# Altium project PCB_Project_H_Bridge.PrjPcb
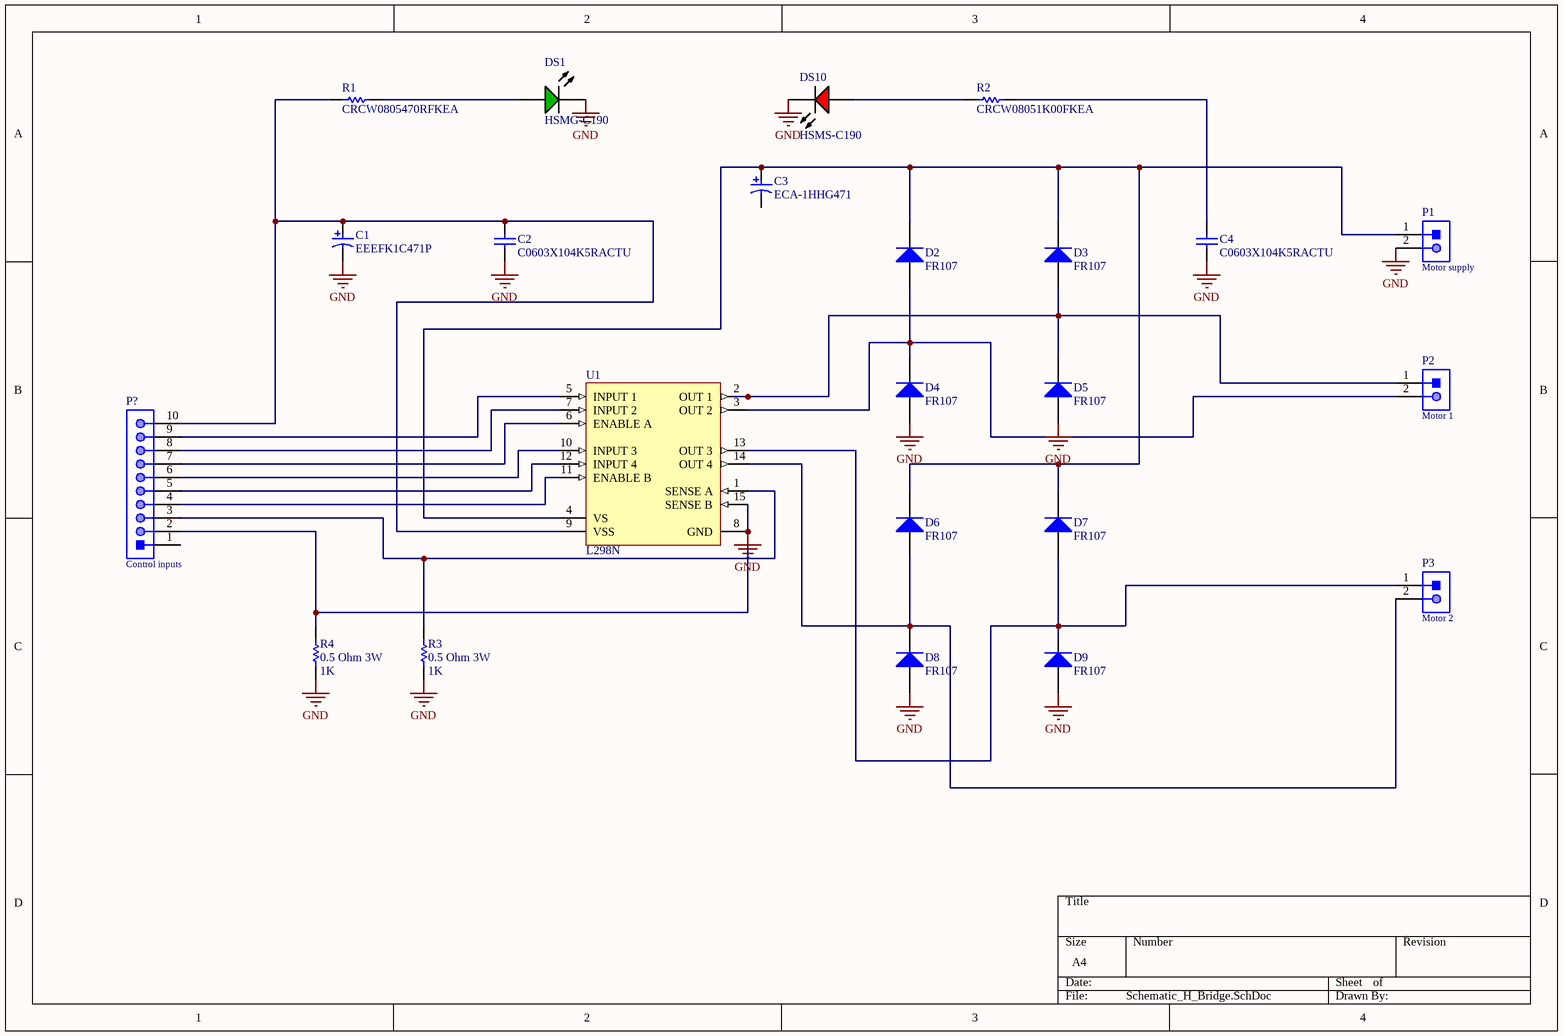
[diagram p0: Schematic_H_Bridge.SchDoc]
1 sheet, 23 parts. Net scope: global (net labels, ports and power ports of the same name join across sheets).

## Sheet Schematic_H_Bridge.SchDoc
size A4

### Parts
C1  EEEFK1C471P  [PNSC-FK-V-F_V]
C2  C0603X104K5RACTU  [CAPC1608X87X35NL15T15]
C3  ECA-1HHG471  [PNSC-CAP-10x20-P2]
C4  C0603X104K5RACTU  [CAPC1608X87X35NL15T15]
D2  FR107  [SMC]
D3  FR107  [SMC]
D4  FR107  [SMC]
D5  FR107  [SMC]
D6  FR107  [SMC]
D7  FR107  [SMC]
D8  FR107  [SMC]
D9  FR107  [SMC]
DS1  HSMG-C190  [AVAG-HSMX-C190_V]
DS10  HSMS-C190  [AVAG-HSMX-C190_V]
P1  Motor supply  [61300211021]
P2  Motor 1  [61300211021]
P3  Motor 2  [61300211021]
P?  Control inputs  [691701320010B]
R1  CRCW0805470RFKEA  [RESC2013X50X30LL20T20]
R2  CRCW08051K00FKEA  [RESC2013X50X30NL20T20]
R3  0.5 Ohm 3W  value 1K  [AXIAL-0.3]
R4  0.5 Ohm 3W  value 1K  [AXIAL-0.3]
U1  L298N  [STM-FM-15]

### Nets
GND: C1.2 C2.1 C4.1 D4.1(A) D5.1(A) D8.1(A) D9.1(A) DS1.2(K) DS10.2(K) P1.2 P?.2 R3.1 R4.1 R4.2 U1.8(GND) U1.15(SENSE_B)
NetC1_1: C1.1 C2.2 P?.10 R1.1 U1.9(VSS)
NetC3_1: C3.1 D2.2(K) D3.2(K) D6.2(K) D7.2(K) P1.1 U1.4(VS)
NetC4_2: C4.2 R2.2
NetD2_1: D2.1(A) D4.2(K) P2.2 U1.3(OUT_2)
NetD3_1: D3.1(A) D5.2(K) P2.1 U1.2(OUT_1)
NetD6_1: D6.1(A) D8.2(K) P3.2 U1.14(OUT_4)
NetD7_1: D7.1(A) D9.2(K) P3.1 U1.13(OUT_3)
NetDS1_1: DS1.1(A) R1.2
NetDS10_1: DS10.1(A) R2.1
NetP?_3: P?.3 R3.2 U1.1(SENSE_A)
NetP?_4: P?.4 U1.11(ENABLE_B)
NetP?_5: P?.5 U1.12(INPUT_4)
NetP?_6: P?.6 U1.10(INPUT_3)
NetP?_7: P?.7 U1.6(ENABLE_A)
NetP?_8: P?.8 U1.7(INPUT_2)
NetP?_9: P?.9 U1.5(INPUT_1)

Not connected (* = marked no-connect by the designer): C3 2; P? 1

### Library data of the parts
C1 = CMP-2000-06204-1: Aluminum Electrolytic Capacitor, 470 uF, +/- 20%, 16 V, 2-Pin SMD (Size Code F), -55 to 105 degC, RoHS, Tape and Reel; Manufacturer: Panasonic; Capacitance: 470µF; Type: Can; Ripple Current: 600mA; Lifetime@Temperature: 2000Hrs@105°C; Impedance: 0.16O; Rated Voltage: 16V; Manufacturer URL: http://www.panasonic.com/; Package Description: 2-Pin Electrolytic Aluminum Capacitor, Body 8.3 x 8.3 mm; Operating Temp-Max: 105°C; Mounting Technology: SurfaceMount; Operating Temp Range: -55to+105°C; Datasheet Version: 03/2016; Series: FK; Package Reference: FK-V-F; Case Size/Dimension: Ø8x10.2mm; Package URL: http://industrial.panasonic.com/cdbs/www-data/pdf/RDE0000/DME0000COL48.pdf; Datasheet URL: http://industrial.panasonic.com/cdbs/www-data/pdf/RDE0000/ABA0000C1181.pdf
C2 C4 = CMP-2006-03300-1: Manufacturer: Kemet; Part Number: C0603X104K5RACTU
C3 = CMP-2000-05308-1: Aluminum Electrolytic Capacitor, 470 uF, +/- 20%, 50 V, -55 to 105 degC, 2-Pin THD, RoHS, Bulk; Manufacturer: Panasonic; Package Version: Nov-12; Type: Radial; Lifetime@Temperature: 2000Hrs@105degC; Capacitance: 470µF; Rated Voltage: 50V; Ripple Current: 530mA; Case Size/Dimension: Ø10x20mm; Package Reference: CAP-10x20-P2; Package Description: 2-Pin Through Hole Device, Dia 10 mm, Body Length 20 mm, Pin Spacing 5 mm; Series: NHG; Datasheet Version: Nov-12; Datasheet URL: http://www.alliedelec.com/images/products/datasheets/bm/Panasonic/70067776.pdf; Package URL: http://www.alliedelec.com/images/products/datasheets/bm/Panasonic/70067776.pdf; Operating Temp-Max: 105degC; Operating Temp Range: -55to+105degC; Manufacturer URL: http://www.panasonic.com/
D2-D9 = Diode: Default Diode; Published: 8-Jun-2000; LatestRevisionDate: 17-Jul-2002; LatestRevisionNote: Re-released for DXP Platform.; PackageVersion: Sep-1996; PackageReference: SMC; Publisher: Altium Limited; PackageDescription: DO-214-AB/SMC; 2 C-Bend Leads; Body 7.9 x 5.9 mm, inc. leads (LxW); Code_JEDEC: DO-214-AB
DS1 = CMP-1744-00002-1: Chip LED, Green, 2.2 V, -40 to 85 degC, 2-Pin SMD, RoHS, Tape and Reel; Frequency: 400 KHz; Max Supply Voltage: 5.5 V; Access Time: 3500 ns; Clock Frequency: 100 KHz; Case\Package: SOIC; Density: 32 kb; Nominal Supply Current: 2 mA; Interface: Serial; Min Supply Voltage: 1.7 V; Packaging: Tape and Reel; PackageReference: HSMX-C190; ComponentLink2URL: http://docs.avagotech.com/docs/AV02-0551EN; RoHSCompliant: true; Pins: 8; REACH SVHC: No SVHC; Max Operating Temperature: 85 degC; Width: 4 mm; Radiation Hardening: No; Package Quantity: 3000; ComponentLink3Description: Package Specification; ComponentLink1Description: Manufacturer URL; Min Operating Temperature: -40 degC; PackageDescription: 2-Pin Surface Mount Device, Body 1.6 x 0.8 mm, Height 0.9 mm; Max Clock Frequency: 100 KHz; Height: 1.5 mm; ComponentLink1URL: http://www.avagotech.com/; DatasheetVersion: Mar-12; ComponentLink2Description: Datasheet; Mount: Surface Mount; Length: 5 mm; ComponentLink3URL: http://www.fairchildsemi.com/dwg/MA/MA03D.pdf
DS10 = CMP-2000-06427-1: LED Uni-Color Red, 52 mW, 20 mA, -40 to 85 degC, 2-Pin SMD, RoHS, Tape and Reel; Manufacturer: Avago; Reverse Voltage: 5V; Viewing Angle: 170deg; High Brightness: No; Lens Type: ColorlessDiffused; DELETED: Compliant; Product Height (mm): 0.8mm; Dominant Wave Length: 626nm; Number of  Elements: 1; Chip Material: GaP; Lum Intensity: 10mcd; Product Length (mm): 1.6mm; Forward Voltage: 2.6V; Power Dissipation: 52W; Shape Type: Rectangular; Forward Current: 25mA; Peak Wavelength: 630nm; Test Current (It): 20mA; Main Category: ChipLED; Lens Dimensions: 1x0.8x0.5mm; Pin Count: 2; Package Reference: HSMX-C190; Mounting Technology: SurfaceMount; Mounting: SurfaceMount; Datasheet URL: http://docs.avagotech.com/docs/AV02-0551EN; Package Type: ChipLed; Operating Temperature Classification: Industrial; Datasheet Version: 03/2012; Operating Temp Range: -40Cto85C; Emitting Color: Red; Rad Hardened: No; Manufacturer URL: http://www.avagotech.com/; Luminous Intensity: 10mcd; Package Description: 2-Pin Surface Mount Device, Body 1.6 x 0.8 mm, Height 0.9 mm; Type: Uni-Color; Packaging: TapeandReel; Product Depth (mm): 0.8mm
P1-P3 = CMP-1502-01059-1: THT Angled Pin Header WR-PHD, Pitch 2.54 mm, Single Row, 2 pins; Manufacturer: Wurth Elektronik; Withstanding Voltage: 500VAC; Gender: Male; Pitch: 2.54mm; Pin Number: 2; Rated Current: 3A; Contact Resistance: 20mOhm; Working Voltage: 250VAC; Mounting Technology: THT; Part Number: 61300211021; Manufacturer URL: http://www.we-online.de; Operating Temperature: -40to105degC; Row Number: Single; Publisher: WurthElektronik; Orientation: Angled; Datasheet URL: https://katalog.we-online.de/em/datasheet/6130xx11021.pdf; Packaging: Bag; Package Reference: 61300211021
P? = CMP-1502-02000-1: Serie 7013 B - 3.81mm Vertical PCB Header THR Type with Flanges WR-TBL, 10 pin; Manufacturer: Wurth Elektronik; Pin Number: 10; Gender: Male; Package Reference: 691701320010B; Publisher: WurthElektronik; Manufacturer URL: http://www.we-online.de; Part Number: 691701320010B; Pitch: 3.81mm; Mounting Technology: SMT; Operating Temperature: -40to105degC; Packaging: TapeandReelwithCap; Datasheet URL: http://katalog.we-online.de/em/datasheet/6917013200xxB.pdf
R1 = CMP-2001-03932-1: Manufacturer: Vishay Dale; Part Number: CRCW0805470RFKEA
R2 = CMP-2001-03595-1: Manufacturer: Vishay Dale; Part Number: CRCW08051K00FKEA
R3 R4 = Res1: Resistor; Published: 8-Jun-2000; LatestRevisionDate: 17-Jul-2002; LatestRevisionNote: Re-released for DXP Platform.; PackageReference: AXIAL-0.3; Publisher: Altium Limited; PackageDescription: Axial Device, Thru-Hole; 2 Leads; 0.3 in Pin Spacing
U1 = CMP-2000-06526-1: Dual Full-Bridge Driver, 4.8 to 46 V, -40 to 150 degC, 15-Pin FM (MW 15L), RoHS, Tube; Manufacturer: STMicroelectronics; PartNumber: L298; Output Current: 2A; Supply Voltage Max: 7V; Driver Case Style: Multiwatt; Supply Voltage Min: 4.5V; No. of Pins: 15Pins; SVHC: NoSVHC(17-Dec-2015); Output Voltage: 46V; No. of Outputs: 4Outputs; Motor Type: FullBridge; MSL: -; Package Description: 15-Pin Flange Mount, Body 5 x 19.6 mm, Pitch 1.27 mm; Datasheet Version: 01/2000; Package Reference: FM-15; Mounting Technology: ThroughHole; Packaging: Each; Automotive Qualification Standard: -; Product Range: -; Datasheet URL: https://datasheet.ciiva.com/15109/getdatasheetpartid-50682-15109332.pdf; Operating Temperature Max: 130°C; Operating Temperature Min: -25°C; Manufacturer URL: http://www.st.com/